# EAGLE design Super-Regenerative-Receiver-2Transistor-ElektorSeptember2007 (EAGLE 7.6.0)
Elektor FM Broadcast Super-Regenerative Receiver Burkhard Kainka's super-regenerative FM receiver from Elektor September 2007. http://www.vk2zay.net/article/195 http://siva666siva.webs.com/FM.PDF
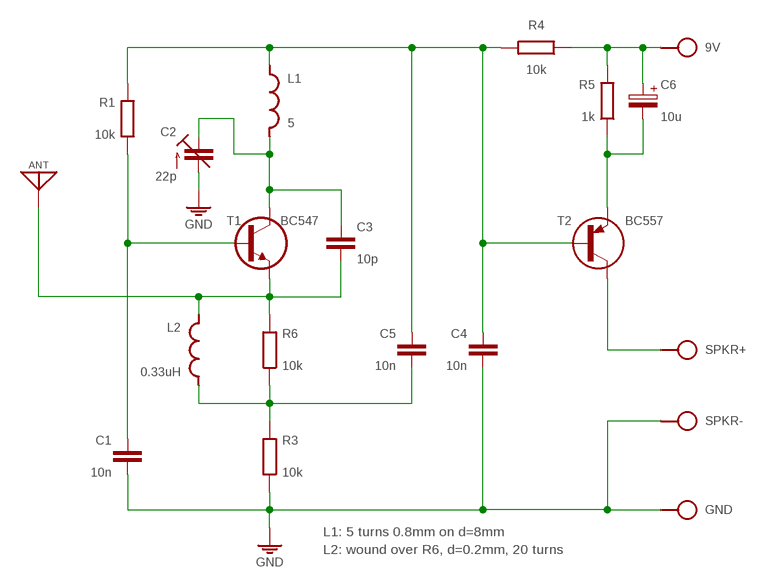
[diagram p0: schematic, sheet 1]

## Parts
9V  SPAD  [SPAD]
ANT  ANT  [SPAD]
C1  10n  C050-020X036  [C050-020X036]
C2  22p  C-TR-PH201272222-808-2PINB  [TRIM-2222-808]
C3  10p  C050-020X036  [C050-020X036]
C4  10n  C050-020X036/V  [C050-020X036/V]
C5  10n  C050-020X036/V  [C050-020X036/V]
C6  10u  CPOLE2,5-3  [E2,5-3]
GND  SPAD  [SPAD]
L1  5  L-SHORTL-04/7V-X  [L-04/7V-X]
L2  0.33uH  L-SHORTL-04/7V-X  [L-04/7V-X]
R1  10k  R0202/7  [0202/7]
R3  10k  R0202V  [0202V]
R4  10k  R0202/7  [0202/7]
R5  1k  R0202/7-V  [0202/7-V]
R6  10k  R0202/7-V  [0202/7-V]
SPKR+  SPAD  [SPAD]
SPKR-  SPAD  [SPAD]
T1  BC547  BC547CBE  [TO92-CBE]
T2  BC557  BC557CBE-A  [TO92-CBE-A]

## Nets
GND: C1.2 C2.2(A) C4.2 GND.1 R3.1 SPKR-.1
N$1: C1.1 R1.1 T1.B
N$2: C6.- R5.1 T2.E
N$3: C5.2 L2.1 R3.2 R6.1
N$4: ANT.1 C3.2 L2.2 R6.2 T1.E
N$5: C4.1 C5.1 L1.2 R1.2 R4.2 T2.B
N$7: 9V.1 C6.+ R4.1 R5.2
N$8: SPKR+.1 T2.C
N$9: C2.3(E) C3.1 L1.1 T1.C

## Notes on the sheet
- L1: 5 turns 0.8mm on d=8mm
- L2: wound over R6, d=0.2mm, 20 turns

## Library data of the parts
9V GND SPKR+ SPKR- = pad:SPAD
ANT = pad:ANT
C1 C3-C5 = c:C: CAPACITOR, European symbol
C2 = cap-trim:C-TR-PH20127
C6 = c:CPOL: POLARIZED CAPACITOR, European symbol
L1 L2 = l:L-SHORT
R1 R3-R6 = r:R: RESISTOR, European symbol
T1 = t:BC547
T2 = t:BC557

## Net classes
0 default: width 0.61 mm

## Board
Elektor FM Broadcast Super-Regenerative Receiver Burkhard Kainka's super-regenerative FM receiver from Elektor September 2007. http://www.vk2zay.net/article/195 http://siva666siva.webs.com/FM.PDF
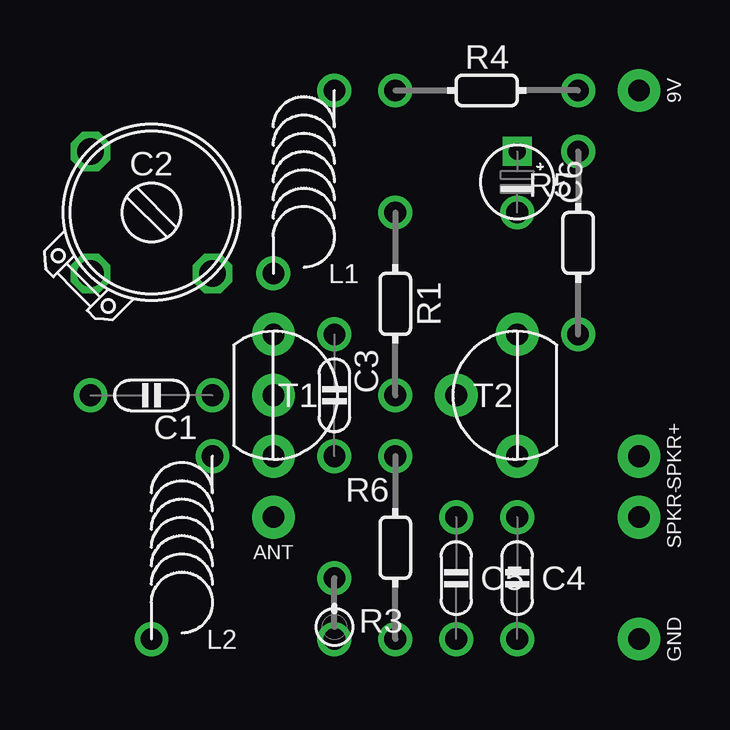
[diagram p1: board, top side]
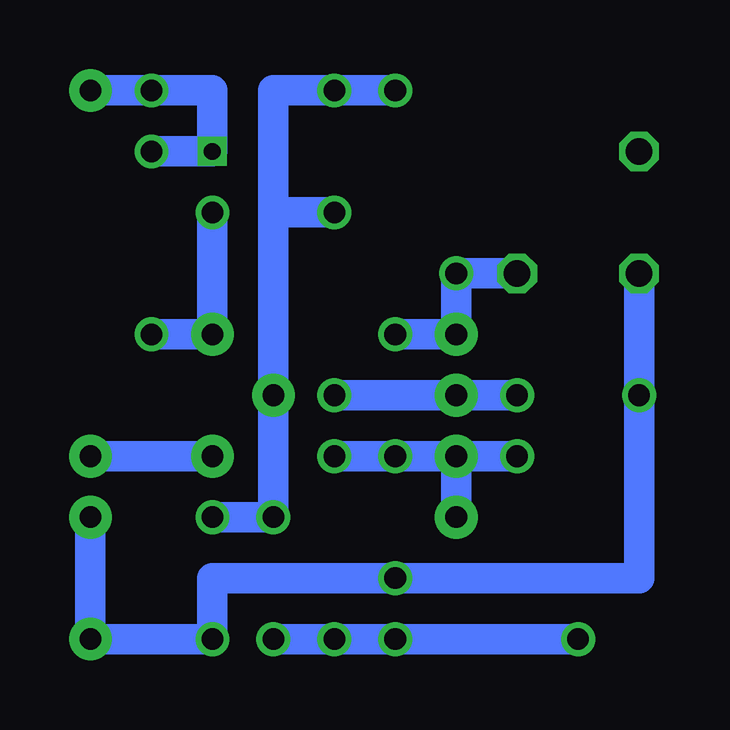
[diagram p2: board, bottom side, seen from below]

No outline drawn. Coordinates in mm, seen from the top.
Copper layers (1*16): Top 0.035mm / dielectric 1.5mm / Bottom 0.035mm
Design rules "default": minimum track width 10mil, minimum drill 24mil, track to track 8mil, track to pad 8mil, pad to pad 8mil, via to via 8mil, smd to smd 8mil, copper to edge 40mil, drill to drill 8mil, minimum pad ring 10mil, minimum via ring 8mil, stop-mask expansion 4mil, vias tented up to drill 0mil, thermal gap 10mil

### Footprints (pad centres in the part's own frame; a part is rotated, then mirrored left to right if it is on the bottom)
SPAD = drill 0.9 pad 1.778: 1 0,0
C050-020X036 = drill 0.9: 1 -2.54,0; 2 2.54,0
TRIM-2222-808 = drill 1.1 octagon: 1 -2.54,2.54; 2 -2.54,-2.54; 3 2.54,-2.54
C050-020X036/V = drill 0.9: 1 0,-2.54; 2 0,2.54
E2,5-3 = drill 0.7 square: + 0,1.27 | drill 0.9: - 0,-1.27
L-04/7V-X = drill 0.9: 1 -1.27,-3.81; 2 1.27,3.81
0202/7 = drill 0.9: 1 0,3.81; 2 0,-3.81
0202V = drill 0.9: 1 0,-1.27; 2 0,1.27
0202/7-V = drill 0.9: 1 0,-3.81; 2 0,3.81
TO92-CBE = drill 0.9 pad 1.778: B 0,0; C 0,2.54; E 0,-2.54
TO92-CBE-A = drill 0.9 pad 1.778: B 2.54,0; C 0,2.54; E 0,-2.54

### Placement (x,y rotation side)
9V  25.4,25.4 180 top
ANT  10.16,7.62 90 top
C1  5.08,12.7 180 top
C2  5.08,20.32 0 top
C3  12.7,12.7 270 top
C4  20.32,5.08 180 top
C5  17.78,5.08 180 top
C6  20.32,21.59 0 top
GND  25.4,2.54 180 top
L1  11.43,21.59 0 top
L2  0.33μH  [L-04/7V-X]  6.35,6.35 0 top
R1  10kΩ  [0202/7]  15.24,16.51 180 top
R3  10kΩ  [0202V]  12.7,3.81 180 top
R4  10kΩ  [0202/7]  19.05,25.4 270 top
R5  1kΩ  [0202/7-V]  22.86,19.05 0 top
R6  10kΩ  [0202/7-V]  15.24,6.35 0 top
SPKR+  25.4,10.16 180 top
SPKR-  25.4,7.62 180 top
T1  10.16,12.7 0 top
T2  20.32,12.7 180 top

### Tracks (layer width: path | path; a pad name or v marks a point on that pad's centre or on a via)
GND
  Bottom 1.27: SPKR-.1 GND.1 C4.2 20.32,5.08 R3.1 2.54,5.08 C1.2 C2.2
N$1
  Bottom 1.27: R1.1 T1.B C1.1
N$2
  Bottom 1.27: C6.- T2.E R5.1
N$3
  Bottom 1.27: R3.2 L2.1 R6.1 C5.2
N$4
  Bottom 1.27: C3.2 R6.2 T1.E | T1.E ANT.1 | L2.2 T1.E
N$5
  Bottom 1.27: 17.78,20.32 17.78,25.4 R4.2 L1.2 | R1.2 17.78,20.32 | 17.78,20.32 T2.B C5.1 C4.1
N$7
  Bottom 1.27: 9V.1 R4.1 20.32,25.4 C6.+ R5.2
N$8
  Bottom 1.27: SPKR+.1 T2.C
N$9
  Bottom 1.27: C3.1 T1.C L1.1 C2.3

### Text on the board
Measures: 10 | 9 | 8 | 7 | 6 | 5 | 4 | 3 | 2 | 1 | 1 | 2 | 3 | 4 | 5 | 6 | 7 | 8 | 9 | 10